# Altium schematic sheet 02_Beam_Inputs.SchDoc: BEAM INPUTS
size A4; Author: Henrique Rosa; DrawnBy: Henq / Codex; Engineer: Henrique Rosa; Address1: rua; Address: Bairro; Address3: São Paulo, SP - Brasil; Address4: 55 (11) 9 6825-6715; DocumentNumber: GBS-02; Revision: A; SheetNumber: 03; SheetTotal: 06; Site: henq.com; VersionControl_RevNumber: 03; PageSetup: Record=PageOptions|CenterHorizontal=True|CenterVertical=True|PrintScale=0.98|XCorrection=1.00|YCorrection=1.00|PrintKind=0|BorderSize=5000000|LeftOffset=0|BottomOffset=0|Orientation=2|PaperLength=1000|PaperWidth=1000|Scale=100|PaperSource=7|PrintQuality=-3|MediaType=1|DitherType=10|PrintScaleMode=1|PaperKind=A4|PaperIndex=9
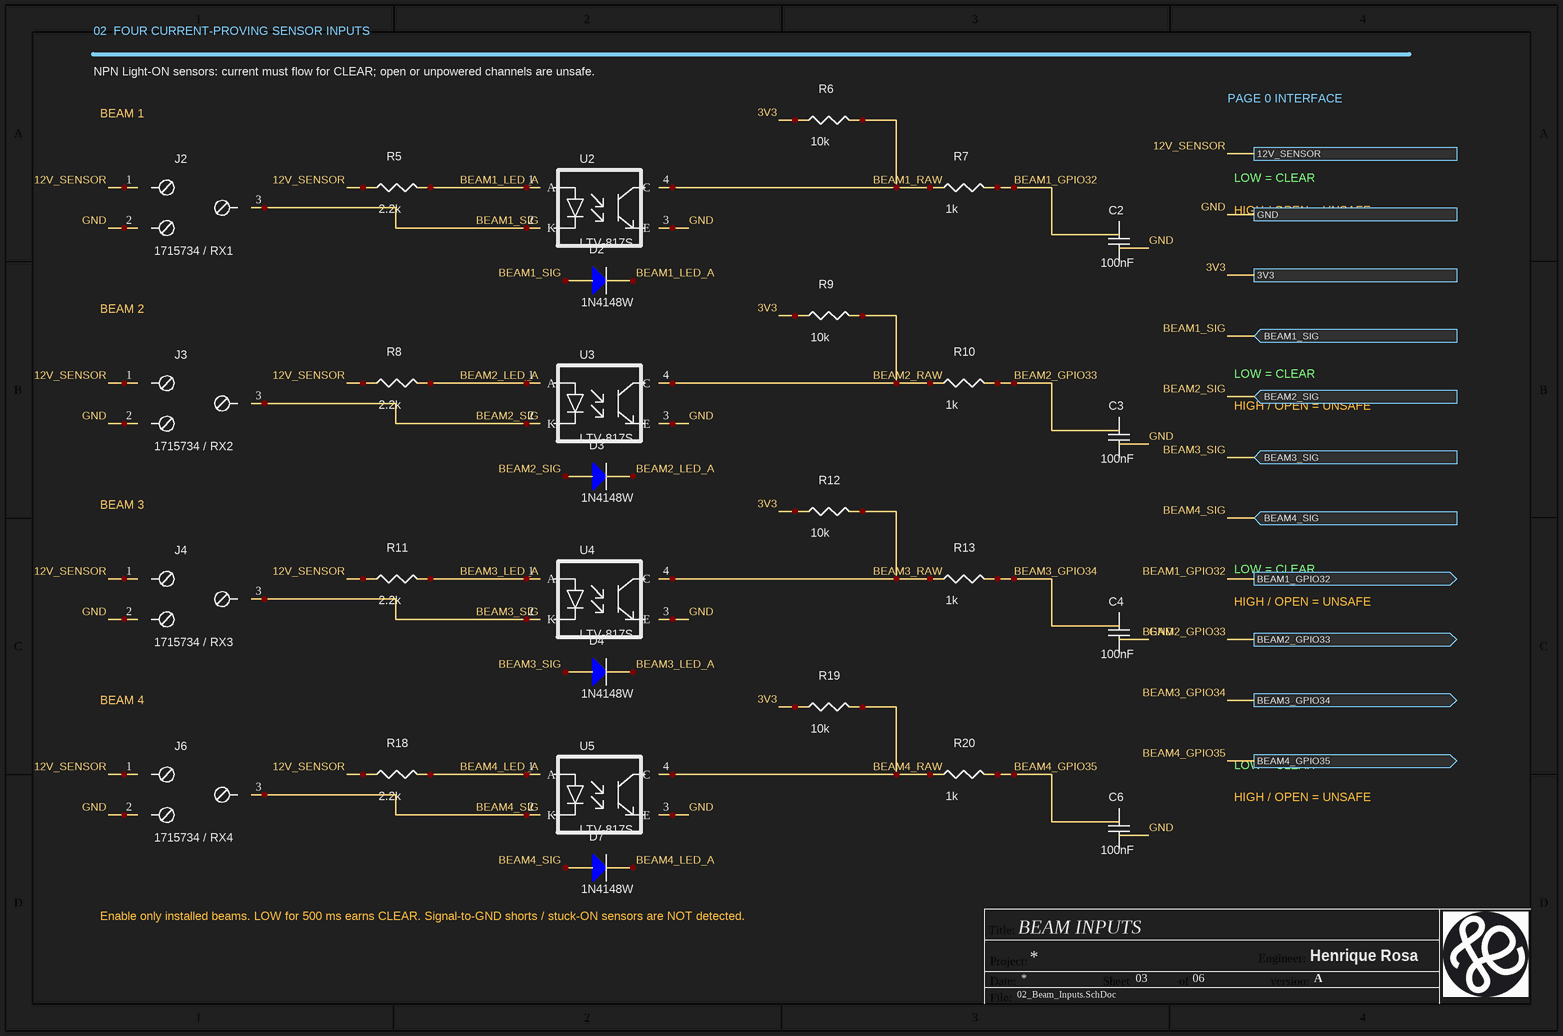
[diagram p0: 02_Beam_Inputs.SchDoc]

## Parts
C2  100nF  [MURATA GRM21B 0805_2012]
C3  100nF  [MURATA GRM21B 0805_2012]
C4  100nF  [MURATA GRM21B 0805_2012]
C6  100nF  [MURATA GRM21B 0805_2012]
D2  1N4148W  [1N4148W_SOD123_A1_K2]
D3  1N4148W  [1N4148W_SOD123_A1_K2]
D4  1N4148W  [1N4148W_SOD123_A1_K2]
D7  1N4148W  [1N4148W_SOD123_A1_K2]
J2  1715734 / RX1  [PHOENIX_1715734_MKDS_3_508]
J3  1715734 / RX2  [PHOENIX_1715734_MKDS_3_508]
J4  1715734 / RX3  [PHOENIX_1715734_MKDS_3_508]
J6  1715734 / RX4  [PHOENIX_1715734_MKDS_3_508]
R5  2.2k  [YAGEO RES 0805_2012]
R6  10k  [YAGEO RES 0805_2012]
R7  1k  [YAGEO RES 0805_2012]
R8  2.2k  [YAGEO RES 0805_2012]
R9  10k  [YAGEO RES 0805_2012]
R10  1k  [YAGEO RES 0805_2012]
R11  2.2k  [YAGEO RES 0805_2012]
R12  10k  [YAGEO RES 0805_2012]
R13  1k  [YAGEO RES 0805_2012]
R18  2.2k  [YAGEO RES 0805_2012]
R19  10k  [YAGEO RES 0805_2012]
R20  1k  [YAGEO RES 0805_2012]
U2  LTV-817S  [LITEON LTV-817]
U3  LTV-817S  [LITEON LTV-817]
U4  LTV-817S  [LITEON LTV-817]
U5  LTV-817S  [LITEON LTV-817]

## Ports
3V3, 12V_SENSOR, BEAM1_GPIO32 (out), BEAM1_SIG (in), BEAM2_GPIO33 (out), BEAM2_SIG (in), BEAM3_GPIO34 (out), BEAM3_SIG (in), BEAM4_GPIO35 (out), BEAM4_SIG (in), GND

## Nets
3V3: R6.1 R9.1 R12.1 R19.1 ; port 3V3
12V_SENSOR: J2.1(+12V) J3.1(+12V) J4.1(+12V) J6.1(+12V) R5.1 R8.1 R11.1 R18.1 ; port 12V_SENSOR
BEAM1_GPIO32: R7.2 ; port BEAM1_GPIO32
BEAM1_LED_A: D2.2(K) R5.2 U2.1(A)
BEAM1_RAW: R6.2 R7.1 U2.4(C)
BEAM1_SIG: D2.1(A) J2.3(OUT) U2.2(K) ; port BEAM1_SIG
BEAM2_GPIO33: R10.2 ; port BEAM2_GPIO33
BEAM2_LED_A: D3.2(K) R8.2 U3.1(A)
BEAM2_RAW: R9.2 R10.1 U3.4(C)
BEAM2_SIG: D3.1(A) J3.3(OUT) U3.2(K) ; port BEAM2_SIG
BEAM3_GPIO34: R13.2 ; port BEAM3_GPIO34
BEAM3_LED_A: D4.2(K) R11.2 U4.1(A)
BEAM3_RAW: R12.2 R13.1 U4.4(C)
BEAM3_SIG: D4.1(A) J4.3(OUT) U4.2(K) ; port BEAM3_SIG
BEAM4_GPIO35: R20.2 ; port BEAM4_GPIO35
BEAM4_LED_A: D7.2(K) R18.2 U5.1(A)
BEAM4_RAW: R19.2 R20.1 U5.4(C)
BEAM4_SIG: D7.1(A) J6.3(OUT) U5.2(K) ; port BEAM4_SIG
GND: J2.2(0V) J3.2(0V) J4.2(0V) J6.2(0V) U2.3(E) U3.3(E) U4.3(E) U5.3(E) ; port GND

Not connected (* = marked no-connect by the designer): C2 1 2; C3 1 2; C4 1 2; C6 1 2

## Notes on the sheet
- 02  FOUR CURRENT-PROVING SENSOR INPUTS
- NPN Light-ON sensors: current must flow for CLEAR; open or unpowered channels are unsafe.
- PAGE 0 INTERFACE
- BEAM 1
- LOW = CLEAR
- HIGH / OPEN = UNSAFE
- BEAM 2
- BEAM 3
- BEAM 4
- (near D7) Enable only installed beams. LOW for 500 ms earns CLEAR. Signal-to-GND shorts / stuck-ON sensors are NOT detected.
- Title:
- Project:
- Date:
- Sheet
- of
- Engineer:
- version:
- File:
- Title
- Size:
- A4
- Number:
- Time:
- Revision:

## Library data of the parts
C2-C4 C6 = Capacitor Cerâmico SMD: Input RC filter; Manufacturer: Murata; cod.: 186030; Symbol source: Conventional symbol reused from ENERGY.SchDoc; CAD status: Native Celestial footprint with embedded STEP; existing electrical symbol and pin positions retained; fabrication checks pending; Valor: 100nF; Manufacturer Part Number: GRM21BR71H104KA01L; Intended footprint: MURATA GRM21B 0805_2012; Footprint source: Celestial Altium Library / Mark Harris / https://altiumlibrary.com; Value: 100nF
D2-D4 D7 = Diode: Reverse clamp: A to SIG; K to opto LED anode; Part Number: FDLL4148; Manufacturer: Nexperia; Symbol source: Conventional symbol reused from ENERGY.SchDoc; CAD status: Pin link repaired; placement/routing/DRC not released; LatestRevisionDate: 17-Jul-2002; LatestRevisionNote: Re-released for DXP Platform.; PackageDocument: Sep-1996; PackageReference: SMC; Code_JEDEC: DO-214-AB; Value: value; Manufacturer Part Number: 1N4148W; Intended footprint: 1N4148W_SOD123_A1_K2; Footprint source: Local PinRepairFootprints.PcbLib; source and polarity checked
J2-J4 J6 = *: 12V / GND / NPN signal terminal; Manufacturer: Phoenix Contact; Populate: Yes; CAD status: Native screw-terminal symbol and explicit pad mapping; verify footprint/body before production; Wiring: 1 brown +12V; 2 blue 0V; 3 black NPN output; Symbol provenance: Project-authored native Altium library; based on identified manufacturer part and pinout, not vendor-issued CAD; Manufacturer Part Number: 1715734; Package: MKDS 1,5/3-5,08; Intended footprint: PHOENIX_1715734_MKDS_3_508; Datasheet: https://www.phoenixcontact.com/en-us/products/printed-circuit-board-terminal-mkds-15-3-508-1715734
R5 R8 R11 R18 = Res3: Optocoupler LED current limit; Manufacturer: Yageo; Grupo: 01; cod.: 185070; Symbol source: Conventional symbol reused from ENERGY.SchDoc; CAD status: Native Celestial footprint with embedded STEP; existing electrical symbol and pin positions retained; fabrication checks pending; Valor: 2.2k; Manufacturer Part Number: RC0805FR-072K2L; Intended footprint: YAGEO RES 0805_2012; Footprint source: Celestial Altium Library / Mark Harris / https://altiumlibrary.com; Value: 2.2k
R6 R9 R12 R19 = Res3: Pull-up earns unsafe if optocoupler is off; Manufacturer: Yageo; Grupo: 01; cod.: 185070; Symbol source: Conventional symbol reused from ENERGY.SchDoc; CAD status: Native Celestial footprint with embedded STEP; existing electrical symbol and pin positions retained; fabrication checks pending; Valor: 10k; Manufacturer Part Number: RC0805FR-0710KL; Intended footprint: YAGEO RES 0805_2012; Footprint source: Celestial Altium Library / Mark Harris / https://altiumlibrary.com; Value: 10k
R7 R10 R13 R20 = Res3: Input current limit; Manufacturer: Yageo; Grupo: 01; cod.: 185070; Symbol source: Conventional symbol reused from ENERGY.SchDoc; CAD status: Native Celestial footprint with embedded STEP; existing electrical symbol and pin positions retained; fabrication checks pending; Valor: 1k; Manufacturer Part Number: RC0805FR-071KL; Intended footprint: YAGEO RES 0805_2012; Footprint source: Celestial Altium Library / Mark Harris / https://altiumlibrary.com; Value: 1k
U2-U5 = *: Phototransistor optocoupler; Manufacturer: Lite-On; Populate: Yes; CAD status: Native Celestial footprint with embedded STEP; existing electrical symbol and pin positions retained; fabrication checks pending; Manufacturer Part Number: LTV-817S-TA1; Package: SMD4; Intended footprint: LITEON LTV-817; Footprint source: Celestial Altium Library / Mark Harris / https://altiumlibrary.com; Value: LTV-817S; Valor: LTV-817S